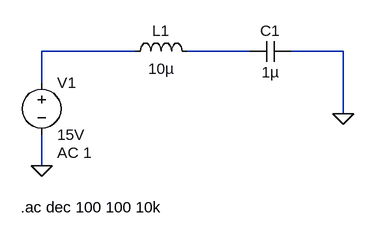
[diagram p0: schematic Bode Plot Test.asc]
Bode Plot Test.asc, the LTspice schematic file:
Version 4
SHEET 1 880 680
WIRE 256 48 112 48
WIRE 432 48 336 48
WIRE 576 48 496 48
WIRE 112 96 112 48
WIRE 576 144 576 48
WIRE 112 224 112 176
FLAG 576 144 0
FLAG 112 224 0
SYMBOL voltage 112 80 R0
WINDOW 123 24 124 Left 2
WINDOW 39 0 0 Left 0
SYMATTR Value2 AC 1
SYMATTR InstName V1
SYMATTR Value 15V
SYMBOL ind 240 64 R270
WINDOW 0 32 56 VTop 2
WINDOW 3 5 56 VBottom 2
SYMATTR InstName L1
SYMATTR Value 10µ
SYMBOL cap 432 64 R270
WINDOW 0 32 32 VTop 2
WINDOW 3 0 32 VBottom 2
SYMATTR InstName C1
SYMATTR Value 1µ
TEXT 80 288 Left 2 !.ac dec 100 100 10k

The netlist it stands for:
* Bode Plot Test.asc
V1 N001 0 15V AC 1
L1 N001 N002 10µ
C1 N002 0 1µ
.ac dec 100 100 10k
.backanno
.end